# Altium schematic sheet Sheet1.SchDoc
size A3; SheetNumber: 1; SheetTotal: 1
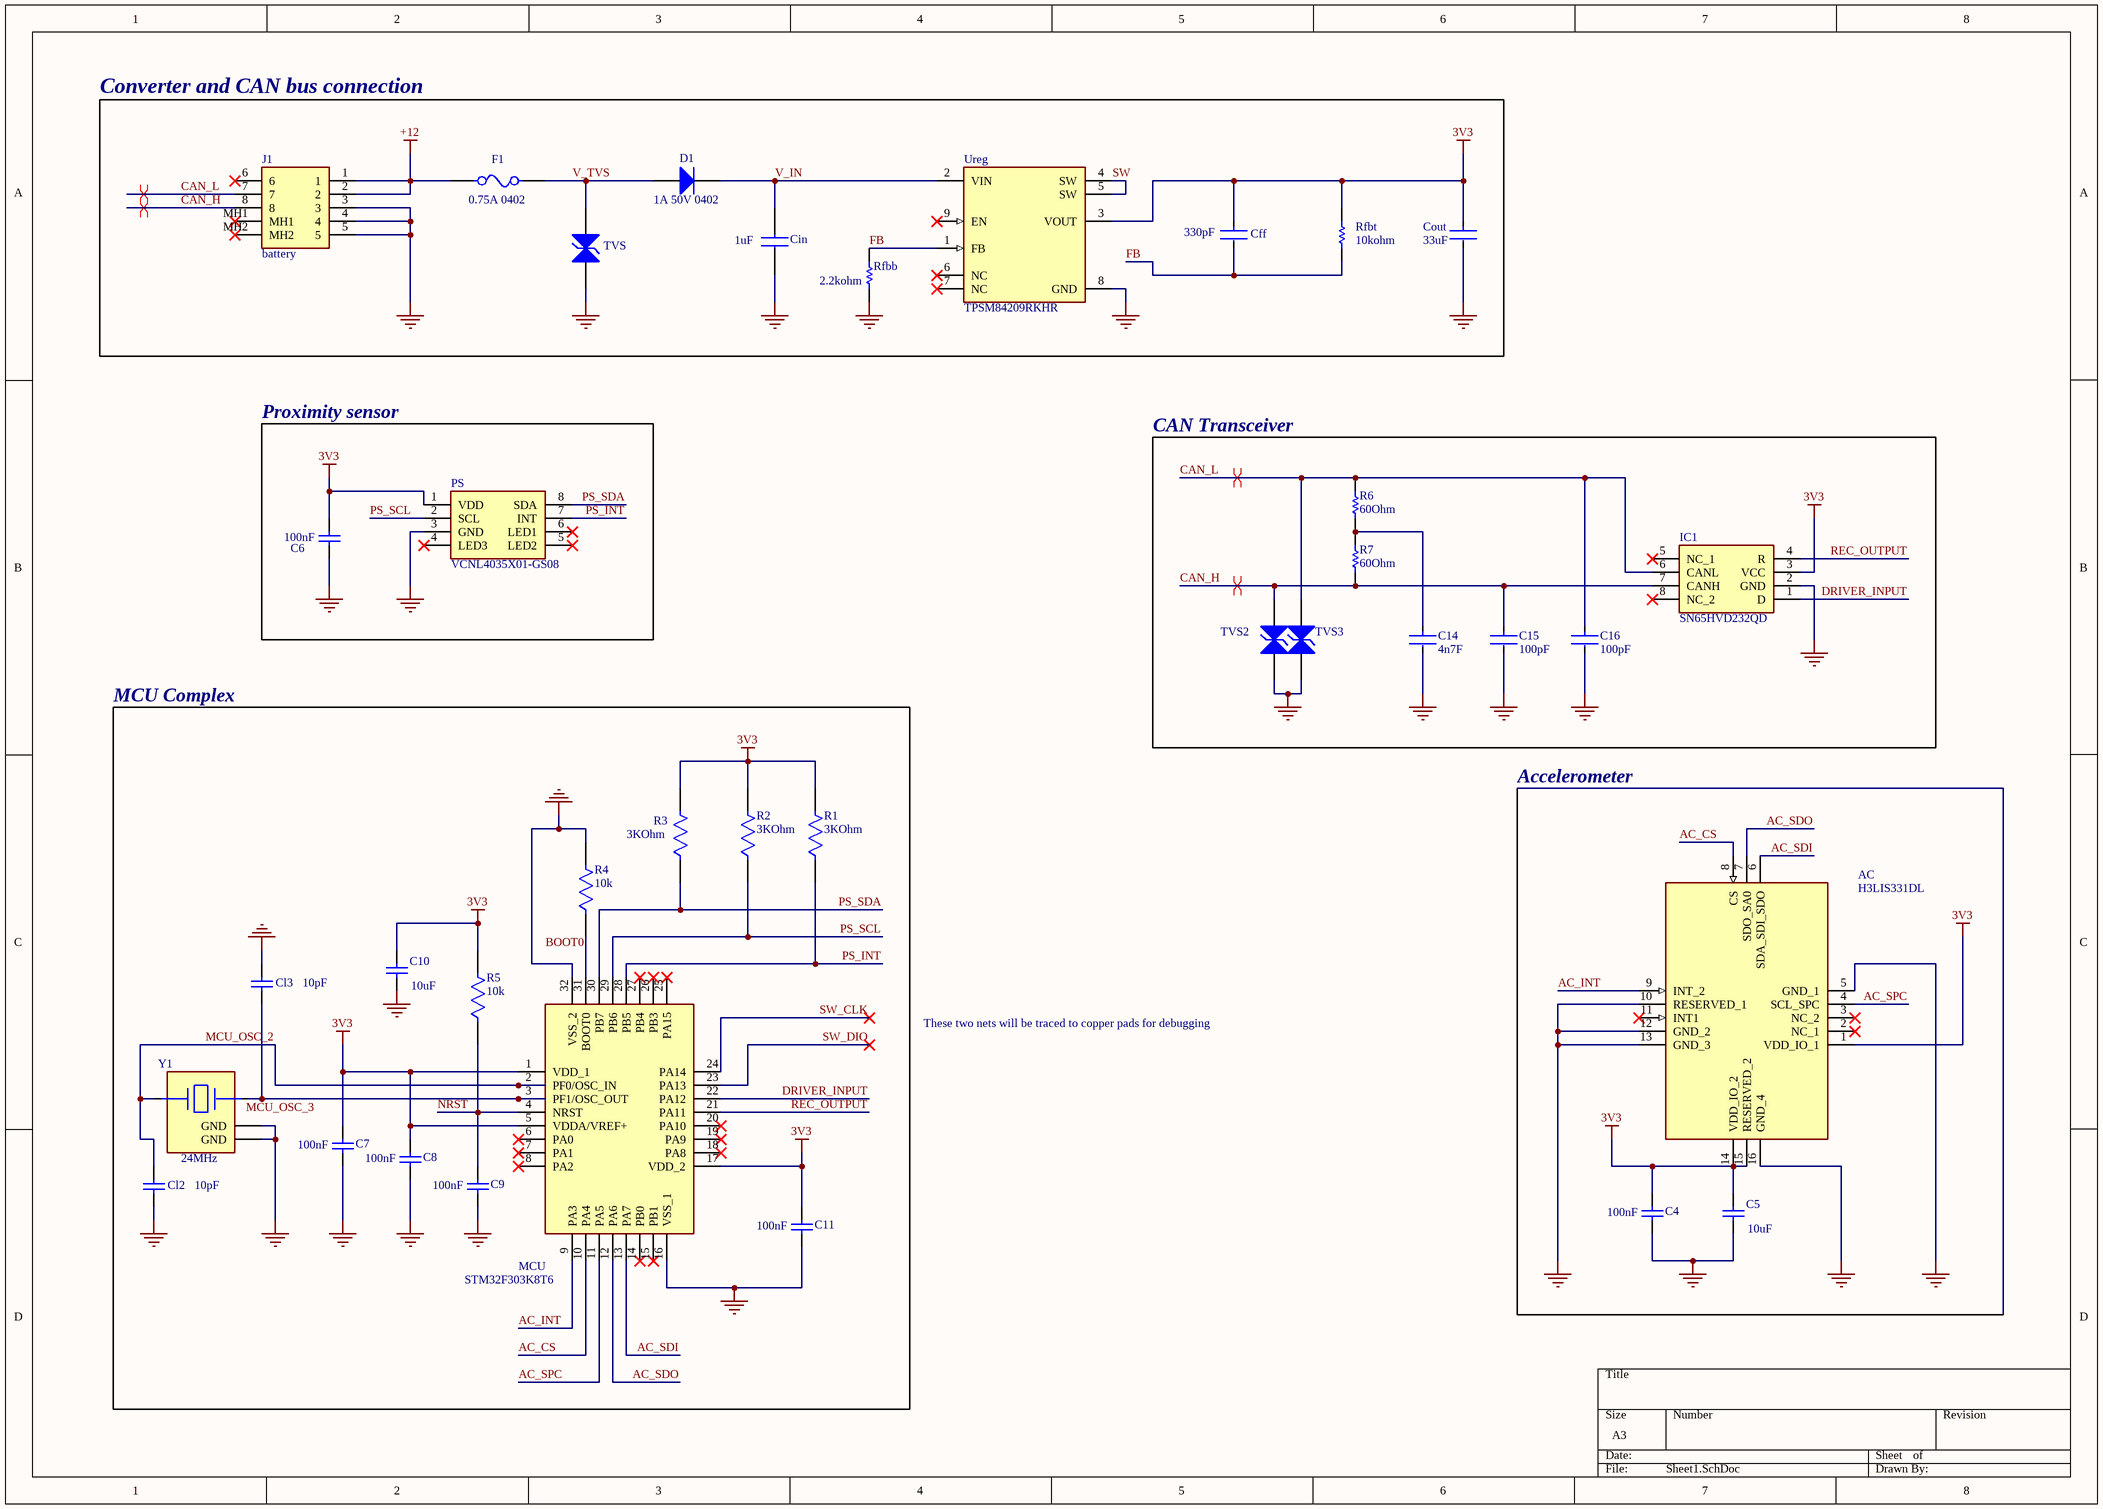
[diagram p0: Sheet1.SchDoc]

## Parts
AC  H3LIS331DL  [LIS3DHTR]
C4  100nF  [CAPC1005X55X30NL05T10]
C5  10uF  [WCAP-CSGP_1206_L3.2W1.6H1.6]
C6  100nF  [CAPC1005X55X30NL05T10]
C7  100nF  [CAPC1005X55X30NL05T10]
C8  100nF  [CAPC1005X55X30NL05T10]
C9  100nF  [CAPC1005X55X30NL05T10]
C10  10uF  [WCAP-CSGP_1206_L3.2W1.6H1.6]
C11  100nF  [CAPC1005X55X30NL05T10]
C14  4n7F  [FP-0201-L_0_6_0_03-W_0_3-IPC_A]
C15  100pF  [FP-CGA1A-0_1-0_03-IPC_B]
C16  100pF  [FP-CGA1A-0_1-0_03-IPC_B]
Cff  330pF  [FP-CGA2B-IPC_A]
Cin  1uF  [CAPC1608X90N]
Cl2  10pF  [CAPC1005X56X25NL10T15]
Cl3  10pF  [CAPC1005X56X25NL10T15]
Cout  33uF  [FP-C2012-125-0_2-IPC_A]
D1  1A 50V 0402  [ONSC-DSN-2-152AC-01_V]
F1  0.75A 0402  [FP-F0402G-MFG]
IC1  SN65HVD232QD  [SOIC127P600X175-8N]
J1  battery  [17762801]
MCU  STM32F303K8T6  [QFP80P900X900X160-32N]
PS  VCNL4035X01-GS08  [VCNL4035X01GS08]
R1  3KOhm  [FP-RMCF0201-IPC_C]
R2  3KOhm  [FP-RMCF0201-IPC_C]
R3  3KOhm  [FP-RMCF0201-IPC_C]
R4  10k  [FP-RT0201-MFG]
R5  10k  [FP-RT0201-MFG]
R6  60Ohm  [RESC0201(0603)_M]
R7  60Ohm  [RESC0201(0603)_M]
Rfbb  2.2kohm  [RESC1608X55X25LL10T15]
Rfbt  10kohm  [RESC1005X40X25ML05T10]
TVS  82357240030  [WE-VE_0402]  (value not drawn)
TVS2  82357240030  [WE-VE_0402]  (value not drawn)
TVS3  82357240030  [WE-VE_0402]  (value not drawn)
Ureg  TPSM84209RKHR  [FP-RKH0009A-MFG]
Y1  24MHz  [FP-TSX-3225-MFG]

## Blocks framed on the sheet
Converter and CAN bus connection: Cff Cin Cout D1 F1 J1 Rfbb Rfbt TVS Ureg
Proximity sensor: C6 PS
CAN Transceiver: C14-C16 IC1 R6 R7 TVS2 TVS3
MCU Complex: C7-C11 Cl2 Cl3 MCU R1-R5 Y1

## Nets
3V3: AC.1(VDD_IO_1) AC.14(VDD_IO_2) AC.15(RESERVED_2) C4.2 C5.2 C6.2 C7.2 C8.2 C10.2 C11.2 Cff.1 Cout.1 IC1.3(VCC) MCU.1(VDD_1) MCU.5(VDDA/VREF+) MCU.17(VDD_2) PS.1(VDD) R1.2 R2.2 R3.2 R5.2 Rfbt.2 Ureg.3(VOUT)
+12: F1.1 J1.1 J1.2
GND: AC.5(GND_1) AC.10(RESERVED_1) AC.12(GND_2) AC.13(GND_3) AC.16(GND_4) C4.1 C5.1 C6.1 C7.1 C8.1 C9.1 C10.1 C11.1 C14.2 C15.2 C16.2 Cin.1 Cl2.1 Cl3.2 Cout.2 IC1.2(GND) J1.3 J1.4 J1.5 MCU.16(VSS_1) MCU.32(VSS_2) PS.3(GND) R4.2 Rfbb.1 TVS.1 TVS2.1 TVS3.1 Ureg.8(GND) Y1.2(GND) Y1.4(GND)
AC_CS: AC.8(CS) MCU.10(PA4)
AC_INT: AC.9(INT_2) MCU.9(PA3)
AC_SDI: AC.6(SDA_SDI_SDO) MCU.13(PA7)
AC_SDO: AC.7(SDO_SA0) MCU.12(PA6)
AC_SPC: AC.4(SCL_SPC) MCU.11(PA5)
BOOT0: MCU.31(BOOT0) R4.1
CAN_H: C15.1 IC1.7(CANH) J1.8 R7.1 TVS2.2
CAN_L: C16.1 IC1.6(CANL) J1.7 R6.2 TVS3.2
DRIVER_INPUT: IC1.1(D) MCU.22(PA12)
FB: Cff.2 Rfbb.2 Rfbt.1 Ureg.1(FB)
MCU_OSC_2: Cl2.2 MCU.2(PF0/OSC_IN) Y1.1
MCU_OSC_3: Cl3.1 MCU.3(PF1/OSC_OUT) Y1.3
NRST: C9.2 MCU.4(NRST) R5.1
PS_INT: MCU.28(PB5) PS.7(INT) R1.1
PS_SCL: MCU.29(PB6) PS.2(SCL) R2.1
PS_SDA: MCU.30(PB7) PS.8(SDA) R3.1
REC_OUTPUT: IC1.4(R) MCU.21(PA11)
SW: Ureg.4(SW) Ureg.5(SW)
SW_CLK: MCU.24(PA14)
SW_DIO: MCU.23(PA13)
V_IN: Cin.2 D1.1(K) Ureg.2(VIN)
V_TVS: D1.2(A) F1.2 TVS.2
NetC14_1: C14.1 R6.1 R7.2

Not connected (* = marked no-connect by the designer): AC 2(NC_1)* 3(NC_2)* 11(INT1)*; IC1 5(NC_1)* 8(NC_2)*; J1 6* MH1* MH2*; MCU 6(PA0)* 7(PA1)* 8(PA2)* 14(PB0)* 15(PB1)* 18(PA8)* 19(PA9)* 20(PA10)* 25(PA15)* 26(PB3)* 27(PB4)*; PS 4(LED3)* 5(LED2)* 6(LED1)*; Ureg 6(NC)* 7(NC)* 9(EN)*

## Layout directives
differential pair: CAN_H, CAN_L

## Notes on the sheet
- Accelerometer
- These two nets will be traced to copper pads for debugging

## Library data of the parts
AC = H3LIS331DL: Accelerometer; Manufacturer_Name: STMicroelectronics; Datasheet Link: http://www.st.com/st-web-ui/static/active/en/resource/technical/document/datasheet/DM00053090.pdf; Height: 1mm; Manufacturer_Part_Number: H3LIS331DL; Mouser Part Number: 511-H3LIS331DL; Mouser Price/Stock: https://www.mouser.co.uk/ProductDetail/STMicroelectronics/H3LIS331DL?qs=TAo1I7FhABscb2spafvd4Q%3D%3D; Arrow Part Number: H3LIS331DL; Arrow Price/Stock: https://www.arrow.com/en/products/h3lis331dl/stmicroelectronics?utm_currency=USD&region=europe
C4 C6-C9 C11 = CMP-2008-03089-1: C0402C104Z8VACTU; Manufacturer: Kemet; Part Number: C0402C104Z8VACTU
C5 C10 = CMP-03913-65419745-2: 10μF ±20% 6.3V Ceramic Capacitor X5R 1206 (3216 Metric) MPN: 885012108002; Insulation Resistance: 5MΩ; Voltage Rating (DC): 6.3V; RoHS: Compliant; Mount: Surface Mount; Capacitance: 10µF; Thickness: 1.905mm; Max Operating Temperature: 85°C; Case Code (Metric): 3216; Min Operating Temperature: -55°C; Voltage Rating: 6.3V; Width: 1.6mm; Case/Package: 1206; Length: 3.2mm; Tolerance: 20%; Case Code (Imperial): 1206; Dielectric: X5R; Height: 1.6mm
C14 = CMP-14477-003729-2: EMK063BJ472KP-F; Capacitance: 4.7nF; Dielectric: X5R; Tolerance: 10%; Voltage Rating: 16V; Package Quantity: 10; RoHS Compliant: Yes; Construction: Flat; Case/Package: 0201; Max Operating Temperature: 85°C; Radiation Hardening: No; Min Operating Temperature: -55°C; Depth: 0.3mm; Height: 0.3mm; Case Code (Metric): 0603; Case Code (Imperial): 0201; Length: 0.024inch; Mount: Surface Mount; Lead Free: Lead Free; Packaging: Tape and Reel; Termination: SMD/SMT; Halogen Free: Halogen Free; Thickness: 0.013inch; Width: 0.012inch; Voltage Rating (DC): 16V; Series: M
C15 C16 = CMP-08246-001685-1: Cap Ceramic 100pF 16V X7R 20% Pad SMD 0201 125°C Automotive T/R MPN: CGA1A2X7R1C101M030BA; Min Operating Temperature: -55°C; Mount: Surface Mount; Capacitance: 100pF; Max Operating Temperature: 125°C; Packaging: Tape and Reel; Length: 0.024inch; Width: 0.012inch; Case Code (Metric): 0603; Tolerance: 20%; Thickness: 0.012inch; Package Quantity: 15000; Ratings: AEC-Q200; Case Code (Imperial): 0201; Case/Package: 0201; Voltage Rating: 16V
Cff = CMP-08246-002132-1: Cap Ceramic 330pF 50V X7R 10% Pad SMD 0402 +125°C Automotive T/R MPN: CGA2B2X7R1H331K050BA; Case Code (Metric): 1005; Depth: 0.5mm; Composition: Ceramic; Mount: Surface Mount; Termination: SMD/SMT; Height: 0.5mm; Dielectric: X7R; Min Operating Temperature: -55°C; Case/Package: 0402; Weight: 2.3E-05oz; Voltage Rating (DC): 50V; REACH SVHC: No SVHC; Tolerance: 10%; Width: 0.02inch; Length: 1mm; Case Code (Imperial): 0402; Voltage Rating: 50V; Max Operating Temperature: 125°C; Radiation Hardening: No; Capacitance: 330pF; Thickness: 0.022inch; Ratings: AEC-Q200; Packaging: Tape and Reel; Package Quantity: 1
Cin = CGA3E3X5R1V105K080AB: Manufacturer_Name: TDK; Datasheet Link: http://docs-europe.electrocomponents.com/webdocs/14e9/0900766b814e9125.pdf; Height: 0.9mm; Manufacturer_Part_Number: CGA3E3X5R1V105K080AB; Mouser Part Number: 810-CGA3E3X5R1V105KB; Mouser Price/Stock: https://www.mouser.co.uk/ProductDetail/TDK/CGA3E3X5R1V105K080AB?qs=xLDY6iXSiQaCrQAC%2FpSDdg%3D%3D; Arrow Part Number: CGA3E3X5R1V105K080AB; Arrow Price/Stock: https://www.arrow.com/en/products/cga3e3x5r1v105k080ab/tdk
Cl2 Cl3 = CMP-2008-02993-1: Part Number: LD025A100JAB2A; Manufacturer: AVX Interconnect / Elco
Cout = CMP-08246-002720-1: Multilayer Ceramic Capacitors 33μF ±20% 10V X5R SMD 0805 MPN: C2012X5R1A336M125AC; Dielectric: X5R; Series: C; Packaging: Tape and Reel; Voltage Rating: 10V; Height: 1.25mm; Tolerance: 20%; Thickness: 0.057inch; Min Operating Temperature: -55°C; Max Operating Temperature: 85°C; Case Code (Imperial): 0805; Capacitance: 33uF; Voltage Rating (DC): 10V; Case Code (Metric): 2012; Length: 2mm; REACH SVHC: No SVHC; Depth: 1.25mm; Package Quantity: 1; Dielectric Material: Ceramic; Lead Free: Lead Free; Case/Package: 0805; Termination: SMD/SMT; Resistor Type: Ceramic; RoHS Compliant: Yes; Width: 0.049inch; Weight: 0.000194oz; Mount: Surface Mount
D1 = CMP-1055-00232-1: Schottky Barrier Diode, 2-Pin DSN, Pb-Free, Tape and Reel; Manufacturer: On Semiconductor; PartNumber: NSR05F40NXT5G; IFSM Max (A): 10; Configuration: Single; RoHS: TRUE; PackageVersion: Rev. C, 01/2011; ComponentLink3Description: Package Specification; ComponentLink3URL: http://www.onsemi.cn/pub_link/Collateral/152AC.PDF; PackageDescription: 2-Pin Micro Molded Package, Body 1 x 0.6 mm; ComponentLink1URL: http://www.onsemi.com/; ComponentLink1Description: Manufacturer URL; Mounting Technology: Surface Mount; Packing: Tape and Reel; PackageReference: DSN-2-152AC-01; ComponentLink2Description: Datasheet; DatasheetVersion: Rev. 3; ComponentLink2URL: http://www.onsemi.cn/pub_link/Collateral/NSR05F40.PDF
F1 = CMP-04585-000002-1: original MPN: F0402G0R05FNTR; Manufacturer: AVX Corporation; Fuse Current: 50mA; Fuse Blow Speed: Fast; Resistance: 3.4Ω; Value: 3.4Ω; Voltage Rating: 32V; Fuse Voltage Drop: 250mV; Lead Free: Yes; Device Class L2: Fuses; ComponentLink2URL: http://datasheets.avx.com/AccuGuardLC_0402.pdf; Automotive: No; Digikey Description: FUSE BOARD MOUNT 50MA 32VDC 0402; Temperature Range Low: -55°C; Device Class L1: Circuit Protection; Octopart: https://octopart.com/f0402g0r05fntr-avx-19631750; ComponentLink2Description: Datasheet; Mouser Description: Surface Mount Fuses 0402 50mA fuse; Device Class L3: unset; Temperature Range High: +125°C; Manufacturer Part Number: F0402G0R05FNTR; Height: 0.4mm; Package: F0402G; RoHS: TRUE; Temperature: -55°C to +125°C; Category: Fuse
IC1 = SN65HVD232QD: Integrated Circuit; Manufacturer_Name: Texas Instruments; Datasheet Link: http://www.ti.com/lit/ds/symlink/sn65hvd232q.pdf; Height: 1.75mm; Manufacturer_Part_Number: SN65HVD232QD; Mouser Part Number: 595-SN65HVD232QD; Mouser Price/Stock: https://www.mouser.co.uk/ProductDetail/Texas-Instruments/SN65HVD232QD?qs=QViXGNcIEAvrVVwvVef1Yg%3D%3D; Arrow Part Number: SN65HVD232QD; Arrow Price/Stock: https://www.arrow.com/en/products/sn65hvd232qd/texas-instruments?utm_currency=USD&region=nac
J1 = 1-776280-1: Connector; Manufacturer_Name: TE Connectivity; Datasheet Link: http://www.te.com/commerce/DocumentDelivery/DDEController?Action=srchrtrv&DocNm=776280&DocType=Customer+Drawing&DocLang=English; Height: 32.1mm; Manufacturer_Part_Number: 1-776280-1; Mouser Part Number: 571-1-776280-1; Mouser Price/Stock: https://www.mouser.co.uk/ProductDetail/TE-Connectivity/1-776280-1?qs=tLAa1RwIH6eAcibenGXn4g%3D%3D; Arrow Part Number: 1-776280-1; Arrow Price/Stock: https://www.arrow.com/en/products/1-776280-1/te-connectivity?region=nac
MCU = STM32F303K8T6: Integrated Circuit; Manufacturer_Name: STMicroelectronics; Datasheet Link: https://www.st.com/resource/en/datasheet/stm32f303c6.pdf; Height: 1.6mm; Manufacturer_Part_Number: STM32F303K8T6; Mouser Part Number: 511-STM32F303K8T6; Mouser Price/Stock: https://www.mouser.co.uk/ProductDetail/STMicroelectronics/STM32F303K8T6?qs=9MuLHSkliconZih9IS1ieg%3D%3D; Arrow Part Number: STM32F303K8T6; Arrow Price/Stock: https://www.arrow.com/en/products/stm32f303k8t6/stmicroelectronics?utm_currency=USD&region=nac
PS = VCNL4035X01-GS08: Integrated Circuit; Manufacturer_Name: Vishay; Datasheet Link: https://www.vishay.com/docs/84251/vcnl4035x01.pdf; Height: 0.75mm; Manufacturer_Part_Number: VCNL4035X01-GS08; Mouser Part Number: 78-VCNL4035X01-GS08; Mouser Price/Stock: https://www.mouser.co.uk/ProductDetail/Vishay-Semiconductors/VCNL4035X01-GS08?qs=yrkI9Pv0ezBEPRCjkOcFyQ%3D%3D; Arrow Part Number: VCNL4035X01-GS08; Arrow Price/Stock: https://www.arrow.com/en/products/vcnl4035x01-gs08/vishay?region=nac
R1 = CMP-26527-003145-1: 3kΩ ±5% 0.05W 0201 Thick Film Chip Resistor AEC-Q200 compliant; Temperature Coefficient: 200ppm/°C; Resistance: 3kR; Max Power Dissipation: 50mW; Packaging: Tape and Reel; Number of Terminations: 2; Contact Plating: Tin; Series: RMCF; RoHS Compliant: Yes; Radiation Hardening: No; Case Code (Metric): 0603; Height: 0.009inch; Mount: Surface Mount; Case Code (Imperial): 0201; Max Operating Temperature: 125°C; Min Operating Temperature: -55°C; Resistor Type: Thick Film; Length: 0.024inch; Width: 0.012inch; Tolerance: 5%; Case/Package: 0201
R2 = CMP-26527-003145-1: 3kΩ ±5% 0.05W 0201 Thick Film Chip Resistor AEC-Q200 compliant MPN:RMCF0201JT3K00; Temperature Coefficient: 200ppm/°C; Resistance: 3kR; Max Power Dissipation: 50mW; Packaging: Tape and Reel; Number of Terminations: 2; Contact Plating: Tin; Series: RMCF; RoHS Compliant: Yes; Radiation Hardening: No; Case Code (Metric): 0603; Height: 0.009inch; Mount: Surface Mount; Case Code (Imperial): 0201; Max Operating Temperature: 125°C; Min Operating Temperature: -55°C; Resistor Type: Thick Film; Length: 0.024inch; Width: 0.012inch; Tolerance: 5%; Case/Package: 0201
R3 = CMP-26527-003145-1: 3kΩ ±5% 0.05W 0201 Thick Film Chip Resistor AEC-Q200 compliant MPN: RMCF0201JT3K00; Temperature Coefficient: 200ppm/°C; Resistance: 3kR; Max Power Dissipation: 50mW; Packaging: Tape and Reel; Number of Terminations: 2; Contact Plating: Tin; Series: RMCF; RoHS Compliant: Yes; Radiation Hardening: No; Case Code (Metric): 0603; Height: 0.009inch; Mount: Surface Mount; Case Code (Imperial): 0201; Max Operating Temperature: 125°C; Min Operating Temperature: -55°C; Resistor Type: Thick Film; Length: 0.024inch; Width: 0.012inch; Tolerance: 5%; Case/Package: 0201
R4 R5 = CMP-03412-006200-1: RT0201 10KΩ 0.05W 50 ppm/°C 0.10% MPN: RT0201BRE0710KL; Manufacturer: Yageo; Voltage Rating: 25V; Tolerance: 0.001; Temperature Range Low: -55°C; Automotive: No; Footprint Url: http://www.yageo.com/exep/pages/download/literatures/PYu-R_Mount_10.pdf; Height: 0.26mm; Device Class L3: Chip SMD Resistors; Lead Free: Yes; Power Rating: 0.05W; Temperature Range High: +125°C; Manufacturer Part Number: RT0201BRE0710KL; Value: 10KΩ; Package: RT0201; ComponentLink2Description: Datasheet; Resistance: 10KΩ; Device Class L2: Resistors; Category: Res; Device Class L1: Passive Components; Composition: Thin Film; Temperature Coefficient: 50 ppm/°C; RoHS: TRUE; ComponentLink2URL: http://www.yageo.com/documents/recent/PYu-RT_1-to-0.01_RoHS_L_9.pdf; Ipc Land Pattern Name: RESC6030X23; Series: RT; Octopart: https://octopart.com/rt0201bre0710kl-yageo-87214258; Temperature: -55°C to +125°C
R6 R7 = CMP-1010-00278-1: 60R4 0.05W 1% 0201 (0603 Metric)  SMD; Value: 60.40 Ohm; Case-Metric: 0603; Case-EIA: 0201; Power: 0.05 W; Tolerance: 1 %; Technology: SMT
Rfbb = CMP-2000-06934-1: Thick Film Resistor, 2.2 KOhm, 100 mW, 50 V, +/- 1%, -55 to 155 degC, 2-Pin SMD (0603), RoHS, Tape and Reel MPN RC0603FR-072K2L; Manufacturer: Yageo; Resistance: 2.2kOhms; Temperature Coefficient: 100PPM/C; Voltage Rating: 50V; Power Rating: 100mW; Tolerance: 1%; Datasheet Version: Rev. 7, 05/2017; Case Code - mm: 1608; Series: RC; Mounting Technology: SurfaceMount; Package Description: 2-Pin Surface Mount Device, Body 1.6 x 0.8 mm; Case Code - in: 0603; Package Reference: 0603; Product: ThickFilmResistorsGeneralPurpose; Manufacturer URL: http://www.yageo.com/; Termination Style: SMD/SMT; Operating Temperature Range: -55Cto+155C; Datasheet URL: http://www.yageo.com/documents/recent/PYu-RC_Group_51_RoHS_L_7.pdf; Packaging: Reel
Rfbt = CMP-2002-03043-1: CRCW040210K0FKED; Part Number: CRCW040210K0FKEDHP; Manufacturer: Vishay Dale
TVS TVS2 TVS3 = CMP-1422-00005-2: NexarPartId: 88496629; Leakage Current: 1µA; Operating Supply Voltage: 24V; Insulation Resistance: 10MΩ; Height: 600µm; Case Code (Metric): 0402; Length: 1mm; Width: 500µm; Case/Package: 0402; RoHS: Non-Compliant
Ureg = CMP-04918-000417-1: DC DC CONVERTER 1.2-6V
Y1 = CMP-36405-000018-1: CRYSTAL 24.0000MHZ 9PF SMD; ESR (Equivalent Series Resistance): 40R; Frequency Stability: 20ppm; Tolerance: 10ppm; Drive Level: 200uW; Min Operating Temperature: -40°C; RoHS Compliant: Yes; Width: 2.5mm; Max Operating Temperature: 105°C; Package Quantity: 250; Load Capacitance: 9pF; Mount: Surface Mount; Lead Free: Lead Free; Height: 0.024inch; Depth: 2.5mm; Frequency: 24MHz; Packaging: Tape and Reel; Series: TSX-3225; Weight: 0.000564oz; Number of Pins: 4; Termination: SMD/SMT; Case/Package: SMD/SMT; Length: 3.2mm; Frequency Tolerance: 10ppm